# Altium schematic sheet ISO_PWR_UCC12040DVER.SchDoc
size A4; SheetNumber: 5; SheetTotal: 9
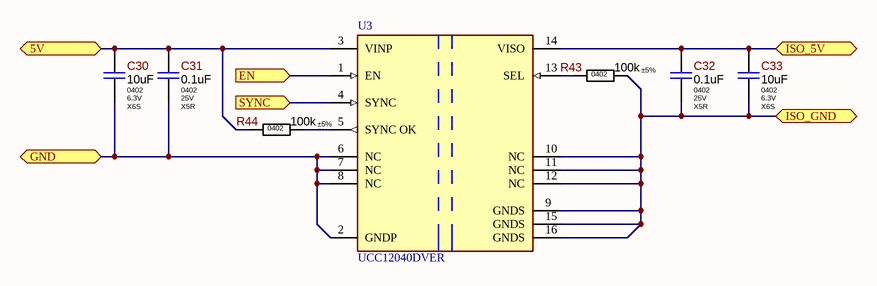
[diagram p0: ISO_PWR_UCC12040DVER.SchDoc]

## Parts
C30  Package: 0402  Voltage: 6.3V  Dielectric Type: X6S  [C_CERAMIC_0402_MED]  (hidden comment: 10uF)
C31  Package: 0402  Voltage: 25V  Dielectric Type: X5R  [C_CERAMIC_0402_MED]  (hidden comment: 0.1uF)
C32  Package: 0402  Voltage: 25V  Dielectric Type: X5R  [C_CERAMIC_0402_MED]  (hidden comment: 0.1uF)
C33  Package: 0402  Voltage: 6.3V  Dielectric Type: X6S  [C_CERAMIC_0402_MED]  (hidden comment: 10uF)
R43  Tolerance: ±5%  Package: 0402  [R_ANY_CHIP_0402_HI]  (hidden comment: 100k)  (no BOM)
R44  Tolerance: ±5%  Package: 0402  [R_ANY_CHIP_0402_HI]  (hidden comment: 100k)  (no BOM)
U3  UCC12040DVER  [FP-DVE0016A-MFG]

## Ports
5V (bidir, see CellVoltageControl[6C]), EN (in, see CellVoltageControl[6C]), GND (bidir, see CellVoltageControl[6C], DC-DC_5V0_To_3V3[2C], DC-DC_24V_To_5V0[1C], MCU_STM32L010K4T6[3B], MCU_STM32L010K4T6[4B], Opto_AQY280SX[2C], RS-485_SN65HVD72DRBR[1B], RS-485_SN65HVD72DRBR[1C]), ISO_5V (bidir, see CellVoltageControl[5C]), ISO_GND (bidir, see CellVoltageControl[5C]), SYNC (in, see CellVoltageControl[6C])

## Nets
5V: C30.1 C31.1 R44.1 U3.3(VINP) ; port 5V
EN: U3.1(EN) ; port EN
GND: C30.2 C31.2 U3.2(GNDP) U3.6(NC) U3.7(NC) U3.8(NC) ; port GND
ISO_5V: C32.1 C33.1 U3.14(VISO) ; port ISO_5V
ISO_GND: C32.2 C33.2 R43.2 U3.9(GNDS) U3.10(NC) U3.11(NC) U3.12(NC) U3.15(GNDS) U3.16(GNDS) ; port ISO_GND
SYNC: U3.4(SYNC) ; port SYNC
NetR43_1: R43.1 U3.13(SEL)
NetR44_2: R44.2 U3.5(SYNC_OK)

## Library data of the parts
C30 C33 = Capacitor-NonPolar: 10uF 6.3V X6S ±20% 0402 Ceramic Capacitor RoHS; Part Number: GRM155C80J106ME11D; Manufacturer: Murata Electronics; Component Status: Released; Standard Lead Time: 15 Weeks; Replacement: NONE; Value: 10uF; Part Type: Ceramic / X6S / 0402; Component Type: SMD; Temperature Range: -55°C ~ 105°C; Tolerance: ±20%; ComponentLink1URL: https://search.murata.co.jp/Ceramy/image/img/A01X/G101/ENG/GRM155C80J106ME11-01.pdf; Supplier 1: Digi-Key; Supplier Part Number 1: 490-13233-1-ND; Price: 0.01104; ComponentLink1Description: Datasheet
C31 C32 = Capacitor-NonPolar: 100nF 25V X5R ±10% 0402 Ceramic Capacitor RoHS; Part Number: CL05A104KA5NNNC; Manufacturer: Samsung Electro-Mechanics; Standard Lead Time: 38 Weeks; Component Status: Released; Replacement: NONE; Value: 0.1uF; Part Type: Ceramic / X5R / 0402; Component Type: SMD; Temperature Range: -55°C ~ 85°C; Tolerance: ±10%; ComponentLink1URL: https://eu.mouser.com/datasheet/2/585/MLCC-1837944.pdf; ComponentLink1Description: Datasheet; Price: 0.0013; Supplier 1: Mouser; Supplier Part Number 1: 187-CL05A104KA5NNNC
R43 R44 = Resistor: 100 kOhms ±5% 1/16W 0402 Thick Film Resistor; Part Number: RC0402JR-07100KL; Manufacturer: Yageo; Power Rating: 0.062W; Voltage: 50V; Component Status: Released; Temperature Stability: ±100ppm/°C; Replacement: NONE; Value: 100k; Component Type: SMD; Part Type: Thick Film; Temperature Range: -55°C ~ 155°C; ComponentLink1URL: https://eu.mouser.com/datasheet/2/447/PYu_RC_Group_51_RoHS_L_10-1664068.pdf; Supplier 1: Digi-Key; Supplier Part Number 1: 311-100KJRTR-ND; Price: 0.00054; ComponentLink1Description: Datasheet
U3 = CMP-04910-000064-1: DC DC CONVERTER 5V 500mW; Number of Outputs: 1; Input Voltage - Min: 4.5V; Input Voltage - Max: 5.5V; Isolation Voltage: 3 kV; Unit Weight: 5 g; Part Number: UCC12040DVER; Supplier 1: Mouser; Supplier Part Number 1: 595-UCC12040DVER; Mounting Style: SMD/SMT; ComponentLink1Description: Datasheet; ComponentLink1URL: https://www.ti.com/lit/ds/symlink/ucc12040.pdf?ts=1755529908774&ref_url=https%253A%252F%252Fwww.ti.com%252Fproduct%252FUCC12040; Output Power: 500 mW; Input Voltage, Nominal: 5V; Package/Case: SOIC-16; Product Type: Isolated DC-DC Converters; Subcategory: DC-DC Converters